# Altium schematic sheet InfoDisplayPower.SchDoc
size A
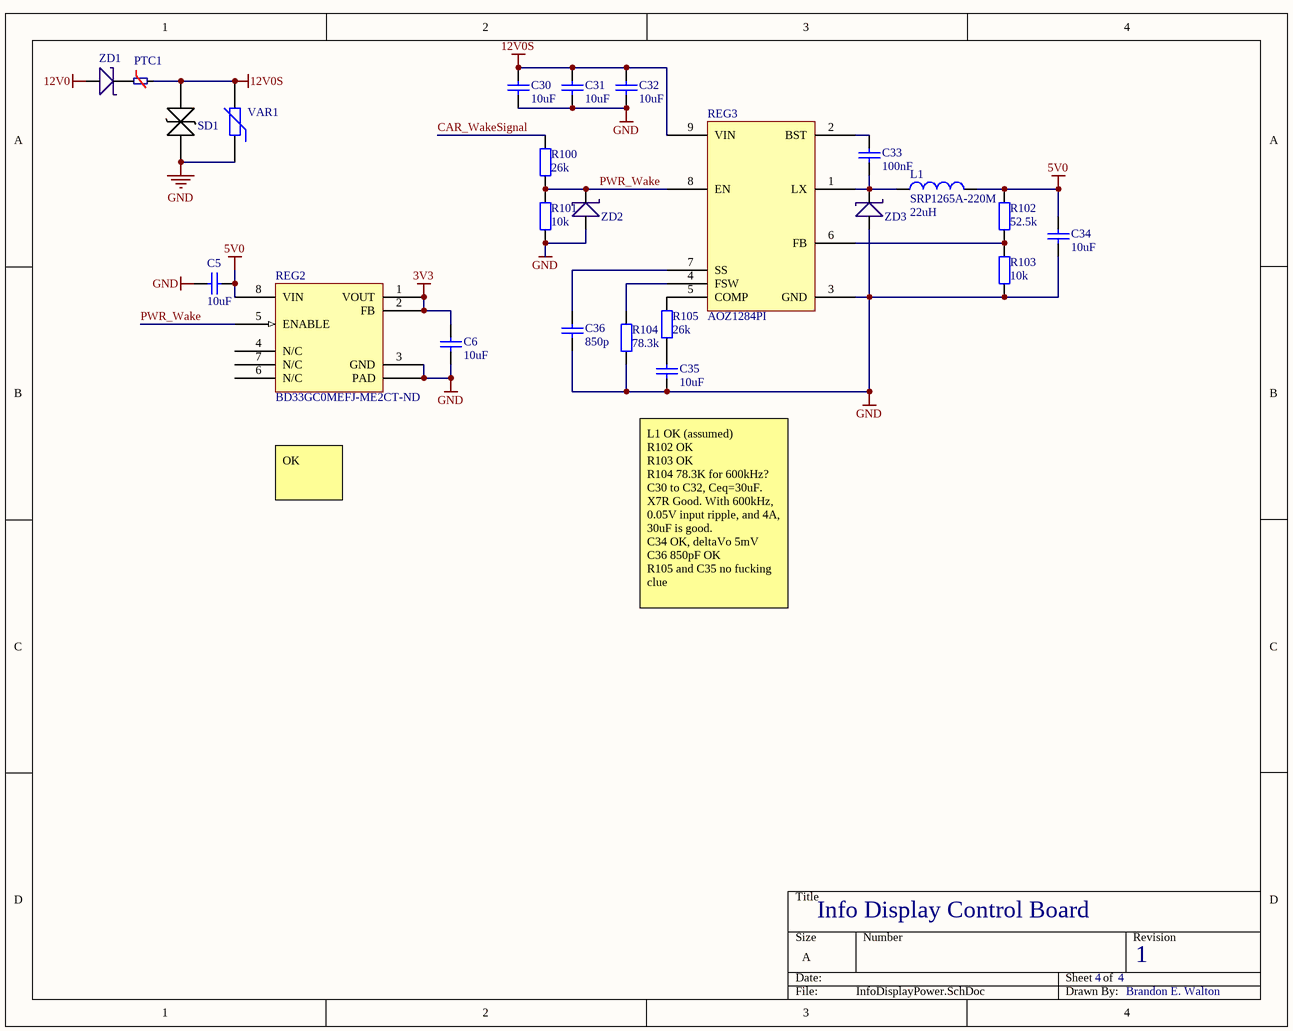
[diagram p0: InfoDisplayPower.SchDoc]

## Parts
C5  value 10uF  [CAPC3216M]  (hidden comment: CGA5L1X7R1E106K160AC)
C6  value 10uF  [CAPC3216M]  (hidden comment: CGA5L1X7R1E106K160AC)
C30  value 10uF  [CAPC3216M]  (hidden comment: CGA5L1X7R1E106K160AC)
C31  value 10uF  [CAPC3216M]  (hidden comment: CGA5L1X7R1E106K160AC)
C32  value 10uF  [CAPC3216M]  (hidden comment: CGA5L1X7R1E106K160AC)
C33  value 100nF  [CAPC1005M]  (hidden comment: GRM155R71C104KA88D)
C34  value 10uF  [CAPC3216M]  (hidden comment: CGA5L1X7R1E106K160AC)
C35  value 10uF  [CAPC3216M]  (hidden comment: CGA5L1X7R1E106K160AC)
C36  value 850p  [RESC0603L]  (hidden comment: GRM033R71E821KA01D)
L1  SRP1265A-220M  value 22uH  [SRP1265A-220M]
PTC1  0ZCF0200AF2C  [0ZCF0200AF2C]  (value not drawn)
R100  value 26k  [1608[0603]]  (hidden comment: MCT06030C2702FP500)
R101  value 10k  [1608[0603]]  (hidden comment: RC0603JR-0710KL)
R102  value 52.5k  [1608[0603]]  (hidden comment: RC0603FR-0752K3L)
R103  value 10k  [1608[0603]]  (hidden comment: RC0603JR-0710KL)
R104  value 78.3k  [RESC1005L]  (hidden comment: RC0402FR-0778K7L)
R105  value 26k  [1608[0603]]  (hidden comment: MCT06030C2702FP500)
REG2  BD33GC0MEFJ-ME2CT-ND  [TSOP127P600X100_HS-9M]
REG3  AOZ1284PI  [SOIC127P600X170_HS-9N]
SD1  UCLAMP1211P.TCT  [CAPC1005M]  (value not drawn)
VAR1  V10P14AUTO  [AXIAL-0.3]  (value not drawn)
ZD1  DB2430100L  [DB2430100L]  (value not drawn)
ZD2  MM3Z3V3ST1G  [SOIC127P250X100-2N]  (value not drawn)
ZD3  DB2431200L  [DB2431200L]  (value not drawn)

## Nets
3V3: C6.1 REG2.1(VOUT) REG2.2(FB)
5V0: C5.2 C34.1 L1.2 R102.2 REG2.8(VIN)
12V0: ZD1.A
12V0S: C30.1 C31.1 C32.1 PTC1.2 REG3.9(VIN) SD1.2 VAR1.2
GND: C5.1 C6.2 C30.2 C31.2 C32.2 C34.2 C35.2 C36.2 R101.1 R103.1 R104.1 REG2.3(GND) REG2.9(PAD) REG3.3(GND) SD1.1 VAR1.1 ZD2.A ZD3.A
CAR_WakeSignal: R100.2
PWR_Wake: R100.1 R101.2 REG2.5(ENABLE) REG3.8(EN) ZD2.K
NetC33_1: C33.1 REG3.2(BST)
NetC33_2: C33.2 L1.1 REG3.1(LX) ZD3.K
NetC35_1: C35.1 R105.1
NetC36_1: C36.1 REG3.7(SS)
NetPTC1_1: PTC1.1 ZD1.K
NetR102_1: R102.1 R103.2 REG3.6(FB)
NetR104_2: R104.2 REG3.4(FSW)
NetR105_2: R105.2 REG3.5(COMP)

Not connected (* = marked no-connect by the designer): REG2 4(N/C) 6(N/C) 7(N/C)

## Notes on the sheet
- OK
- (near C35) L1 OK (assumed)
  R102 OK
  R103 OK
  R104 78.3K for 600kHz?
  C30 to C32, Ceq=30uF. X7R Good. With 600kHz, 0.05V input ripple, and 4A, 30uF is good.
  C34 OK, deltaVo 5mV
  C36 850pF OK
  R105 and C35 no fucking clue
- Info Display Control Board
- 4
- 1
- Brandon E. Walton

## Library data of the parts
C5 C6 C30-C35 = Cap: Capacitor; Published: 8-Jun-2000; LatestRevisionDate: 17-Jul-2002; LatestRevisionNote: Re-released for DXP Platform.; PackageReference: RAD-0.3; Publisher: Altium Limited; PackageDescription: Radial Cap, Thru-Hole; 2 Leads; 0.3 in Pin Spacing
  C5 C6 C30-C32 C34 C35: Digikey: 445-6990-1-ND; PartNumber: CGA5L1X7R1E106K160AC
  C33: Digikey: 490-3261-1-ND; PartNumber: GRM155R71C104KA88D
C36 = Cap: Capacitor; PartNumber: CGA5L1X7R1E106K160AC; Published: 8-Jun-2000; LatestRevisionDate: 17-Jul-2002; LatestRevisionNote: Re-released for DXP Platform.; PackageReference: RAD-0.3; Publisher: Altium Limited; PackageDescription: Radial Cap, Thru-Hole; 2 Leads; 0.3 in Pin Spacing; Digikey: 490-3183-1-ND
L1 = Inductor: Code_IEC: 1005; Published: 8-Jun-2000; LatestRevisionDate: 29-May-2009; LatestRevisionNote: IPC-7351 Footprint Added.; PackageReference: 0402-A; Publisher: Altium Limited; PackageDescription: Chip Inductor; Code_JEITA: 0402; Digikey: SRP1265A-220MCT-ND; Partnumber: SRP1265A-220M
PTC1 = 0ZCF0200AF2C: PTC device, 2A hold, 4A trip; Digikey: 507-1749-1-ND; Manufacturer PartNo: 0ZCF0200AF2C
R100-R105 = Res2: Resistor; Partnumber: RC0603FR-07422KL; Published: 8-Jun-2000; LatestRevisionDate: 17-Jul-2002; LatestRevisionNote: Re-released for DXP Platform.; PackageReference: AXIAL-0.4; Publisher: Altium Limited; PackageDescription: Axial Device, Thru-Hole; 2 Leads; 0.4 in Pin Spacing
  R100 R105: Digikey: MCT0603-27.0K-CFCT-ND
  R101 R103: Digikey: 311-10KGRCT-ND
  R102: Digikey: 311-52.3KHRCT-ND
  R104: Digikey: 311-78.7KLRCT-ND
REG2 = BD33GC0MEFJ-ME2CT-ND: Rohm 3.3V LDO; Digikey: BD33GC0MEFJ-ME2CT-ND; Partnumber: BD33GC0MEFJ-ME2
REG3 = AOZ1284PI: A&M 4A Buck Regulator, 0.8 to 30V; Manufacturer PartNo: AOZ1284PI; Digikey: 785-1689-1-ND
SD1 = UCLAMP0511PQTCT: Semtech TVS Diode; Digikey: UCLAMP1211PCT-ND; PartNumber: UCLAMP1211P.TCT
VAR1 = Res Varistor: Varistor (Voltage-Sensitive Resistor); Published: 24-Mar-1999; LatestRevisionDate: 29-May-2009; LatestRevisionNote: IPC-7351 Footprint Added.; PackageVersion: Mar-2003; PackageReference: 6-0805; Publisher: Altium Limited; PackageDescription: Chip Resistor 0805 Case Size; Code_IPC: RESC2012; Digikey: F6413-ND; Partnumber: V10P14AUTO
ZD1 = DB2430100L: Panasonic Schottky Diode, 2A; Digikey: DB2430100LCT-ND; Partnumber: DB2430100L
ZD2 = DB2430100L: 3.3V Zener Diode; Digikey: MM3Z3V3ST1GOSCT-ND; Partnumber: MM3Z3V3ST1G
ZD3 = DB2430100L: Shottky Diode, 5A, 30V, 510 mV; Digikey: DB2431200LCT-ND; Partnumber: DB2431200L